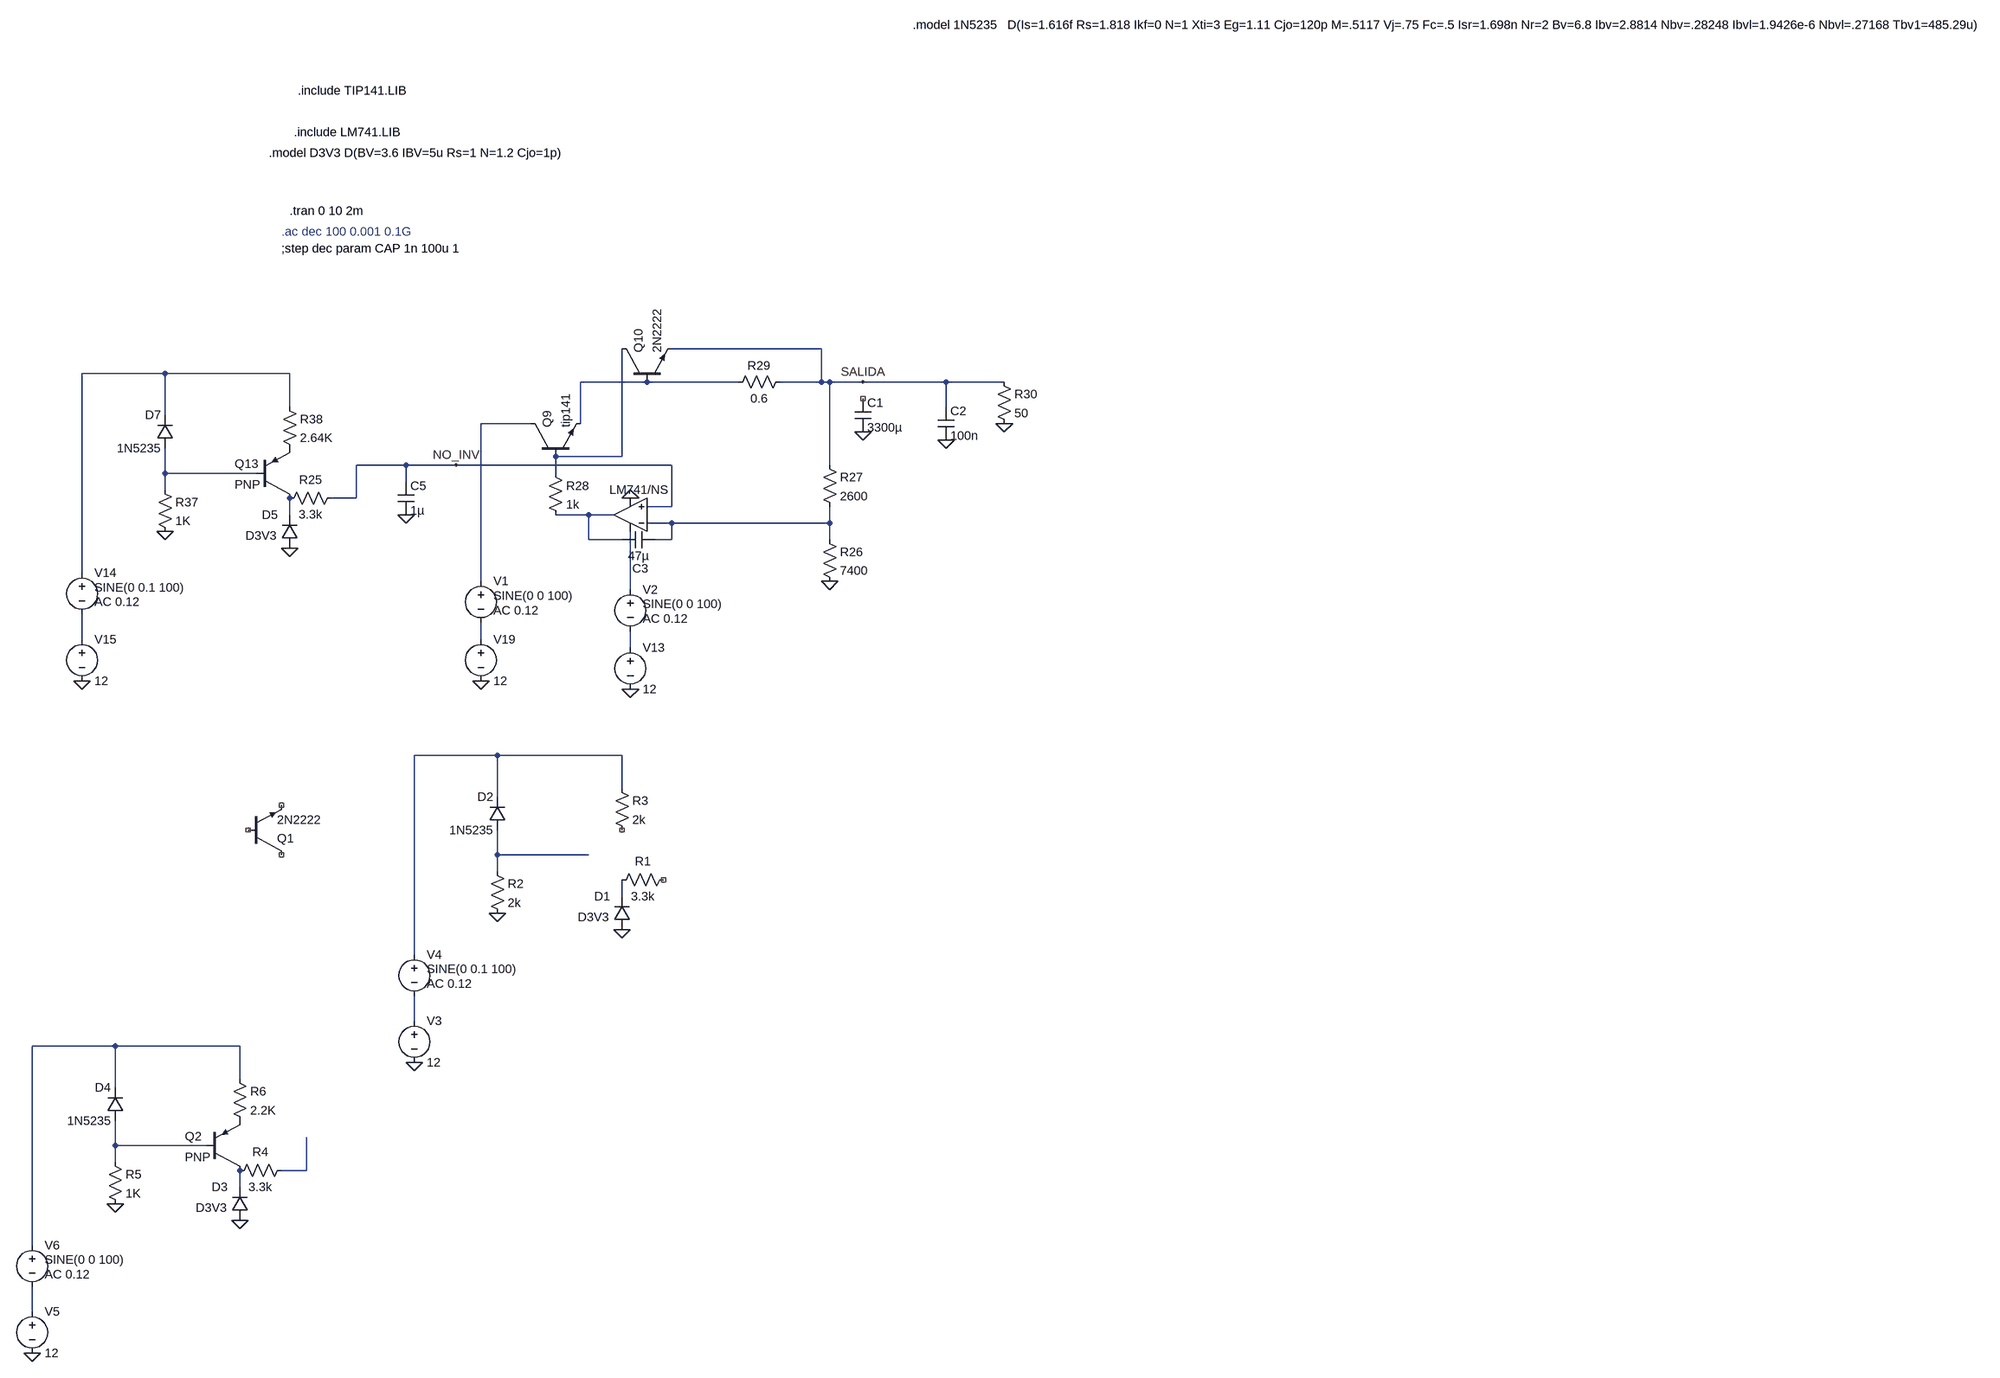
[diagram p0: schematic Estabilizador 5 V_version2.asc]
Estabilizador 5 V_version2.asc, the LTspice schematic file:
Version 4
SHEET 1 1496 2916
WIRE -1712 944 -2000 944
WIRE -2976 992 -3136 992
WIRE -2736 992 -2976 992
WIRE -2048 1008 -2176 1008
WIRE -1872 1008 -2048 1008
WIRE -1712 1008 -1712 944
WIRE -1712 1008 -1792 1008
WIRE -1696 1008 -1712 1008
WIRE -1632 1008 -1696 1008
WIRE -1472 1008 -1632 1008
WIRE -1360 1008 -1472 1008
WIRE -2736 1056 -2736 992
WIRE -1472 1056 -1472 1008
WIRE -2976 1072 -2976 992
WIRE -2272 1088 -2368 1088
WIRE -2176 1088 -2176 1008
WIRE -2096 1152 -2096 944
WIRE -2096 1152 -2224 1152
WIRE -2512 1168 -2608 1168
WIRE -2416 1168 -2512 1168
WIRE -2000 1168 -2416 1168
WIRE -1696 1168 -1696 1008
WIRE -2976 1184 -2976 1136
WIRE -2800 1184 -2976 1184
WIRE -2224 1184 -2224 1152
WIRE -2512 1200 -2512 1168
WIRE -2976 1216 -2976 1184
WIRE -2608 1232 -2608 1168
WIRE -2608 1232 -2656 1232
WIRE -2000 1248 -2000 1168
WIRE -2000 1248 -2048 1248
WIRE -2736 1264 -2736 1232
WIRE -2160 1264 -2224 1264
WIRE -2112 1264 -2160 1264
WIRE -2000 1280 -2048 1280
WIRE -1696 1280 -1696 1248
WIRE -1696 1280 -2000 1280
WIRE -2160 1312 -2160 1264
WIRE -2096 1312 -2160 1312
WIRE -2000 1312 -2000 1280
WIRE -2000 1312 -2032 1312
WIRE -1696 1312 -1696 1280
WIRE -3136 1376 -3136 992
WIRE -2368 1392 -2368 1088
WIRE -2080 1408 -2080 1296
WIRE -3136 1504 -3136 1456
WIRE -2368 1504 -2368 1472
WIRE -2080 1520 -2080 1488
WIRE -2336 1744 -2496 1744
WIRE -2096 1744 -2336 1744
WIRE -2096 1808 -2096 1744
WIRE -2336 1824 -2336 1744
WIRE -2336 1936 -2336 1888
WIRE -2160 1936 -2336 1936
WIRE -2336 1968 -2336 1936
WIRE -2096 2016 -2096 1984
WIRE -2496 2128 -2496 1744
WIRE -2496 2256 -2496 2208
WIRE -3072 2304 -3232 2304
WIRE -2832 2304 -3072 2304
WIRE -2832 2368 -2832 2304
WIRE -3072 2384 -3072 2304
WIRE -3072 2496 -3072 2448
WIRE -2896 2496 -3072 2496
WIRE -3072 2528 -3072 2496
WIRE -2704 2544 -2704 2480
WIRE -2704 2544 -2752 2544
WIRE -2832 2576 -2832 2544
WIRE -3232 2688 -3232 2304
WIRE -3232 2816 -3232 2768
FLAG -2080 1232 0
FLAG -2080 1600 0
FLAG -1696 1392 0
FLAG -2736 1328 0
FLAG -1360 1088 0
FLAG -3136 1584 0
FLAG -2976 1296 0
FLAG -2368 1584 0
FLAG -2512 1264 0
FLAG -1632 1008 SALIDA
FLAG -2416 1168 NO_INV
FLAG -1632 1104 0
FLAG -1472 1120 0
FLAG -2096 2080 0
FLAG -2496 2336 0
FLAG -2336 2048 0
FLAG -2832 2640 0
FLAG -3232 2896 0
FLAG -3072 2608 0
SYMBOL npn -2272 1152 R270
SYMATTR InstName Q9
SYMATTR Value tip141
SYMATTR Prefix X
SYMBOL voltage -2080 1504 R0
WINDOW 123 0 0 Left 2
WINDOW 39 0 0 Left 2
SYMATTR InstName V13
SYMATTR Value 12
SYMBOL res -2640 1216 R90
WINDOW 0 -4 56 VBottom 2
WINDOW 3 32 56 VTop 2
SYMATTR InstName R25
SYMATTR Value 3.3k
SYMBOL res -1712 1296 R0
SYMATTR InstName R26
SYMATTR Value 7400
SYMBOL res -1712 1152 R0
SYMATTR InstName R27
SYMATTR Value 2600
SYMBOL diode -2720 1328 R180
WINDOW 0 39 64 Left 2
WINDOW 3 41 24 Left 2
SYMATTR InstName D5
SYMATTR Value D3V3
SYMBOL res -2240 1168 R0
SYMATTR InstName R28
SYMATTR Value 1k
SYMBOL res -1776 992 R90
WINDOW 0 0 56 VBottom 2
WINDOW 3 32 56 VTop 2
SYMATTR InstName R29
SYMATTR Value 0.6
SYMBOL res -1376 992 R0
SYMATTR InstName R30
SYMATTR Value 50
SYMBOL npn -2096 1008 R270
SYMATTR InstName Q10
SYMATTR Value 2N2222
SYMBOL Opamps\\UniversalOpamp2 -2080 1264 R180
WINDOW 0 -74 48 Left 2
SYMATTR InstName LM741/NS
SYMBOL voltage -3136 1488 R0
WINDOW 123 0 0 Left 2
WINDOW 39 0 0 Left 2
SYMATTR InstName V15
SYMATTR Value 12
SYMBOL diode -2960 1136 R180
WINDOW 0 24 64 Left 2
WINDOW 3 24 0 Left 2
SYMATTR InstName D7
SYMATTR Value 1N5235
SYMBOL res -2992 1200 R0
SYMATTR InstName R37
SYMATTR Value 1K
SYMBOL res -2752 1040 R0
SYMATTR InstName R38
SYMATTR Value 2.64K
SYMBOL pnp -2800 1232 M180
WINDOW 0 -42 66 Left 2
WINDOW 3 -42 26 Left 2
SYMATTR InstName Q13
SYMBOL voltage -2368 1488 R0
WINDOW 123 0 0 Left 2
WINDOW 39 0 0 Left 2
SYMATTR InstName V19
SYMATTR Value 12
SYMBOL voltage -3136 1360 R0
WINDOW 3 24 44 Left 2
WINDOW 123 24 72 Left 2
WINDOW 39 0 0 Left 2
SYMATTR Value SINE(0 0.1 100)
SYMATTR Value2 AC 0.12
SYMATTR InstName V14
SYMBOL cap -2528 1200 R0
SYMATTR InstName C5
SYMATTR Value 1µ
SYMBOL cap -2032 1296 R90
WINDOW 0 87 29 VBottom 2
WINDOW 3 32 32 VTop 2
SYMATTR InstName C3
SYMATTR Value 47µ
SYMBOL voltage -2368 1376 R0
WINDOW 3 24 44 Left 2
WINDOW 123 24 72 Left 2
WINDOW 39 0 0 Left 2
SYMATTR Value SINE(0 0 100)
SYMATTR Value2 AC 0.12
SYMATTR InstName V1
SYMBOL voltage -2080 1392 R0
WINDOW 3 24 44 Left 2
WINDOW 123 24 72 Left 2
WINDOW 39 0 0 Left 2
SYMATTR Value SINE(0 0 100)
SYMATTR Value2 AC 0.12
SYMATTR InstName V2
SYMBOL cap -1648 1040 R0
SYMATTR InstName C1
SYMATTR Value 3300µ
SYMBOL cap -1488 1056 R0
SYMATTR InstName C2
SYMATTR Value 100n
SYMBOL npn -2816 1936 M180
SYMATTR InstName Q1
SYMATTR Value 2N2222
SYMBOL res -2000 1968 R90
WINDOW 0 -4 56 VBottom 2
WINDOW 3 32 56 VTop 2
SYMATTR InstName R1
SYMATTR Value 3.3k
SYMBOL diode -2080 2080 R180
WINDOW 0 39 64 Left 2
WINDOW 3 41 24 Left 2
SYMATTR InstName D1
SYMATTR Value D3V3
SYMBOL voltage -2496 2240 R0
WINDOW 123 0 0 Left 2
WINDOW 39 0 0 Left 2
SYMATTR InstName V3
SYMATTR Value 12
SYMBOL diode -2320 1888 R180
WINDOW 0 24 64 Left 2
WINDOW 3 24 0 Left 2
SYMATTR InstName D2
SYMATTR Value 1N5235
SYMBOL res -2352 1952 R0
SYMATTR InstName R2
SYMATTR Value 2k
SYMBOL res -2112 1792 R0
SYMATTR InstName R3
SYMATTR Value 2k
SYMBOL voltage -2496 2112 R0
WINDOW 3 24 44 Left 2
WINDOW 123 24 72 Left 2
WINDOW 39 0 0 Left 2
SYMATTR Value SINE(0 0.1 100)
SYMATTR Value2 AC 0.12
SYMATTR InstName V4
SYMBOL res -2736 2528 R90
WINDOW 0 -4 56 VBottom 2
WINDOW 3 32 56 VTop 2
SYMATTR InstName R4
SYMATTR Value 3.3k
SYMBOL diode -2816 2640 R180
WINDOW 0 39 64 Left 2
WINDOW 3 41 24 Left 2
SYMATTR InstName D3
SYMATTR Value D3V3
SYMBOL voltage -3232 2800 R0
WINDOW 123 0 0 Left 2
WINDOW 39 0 0 Left 2
SYMATTR InstName V5
SYMATTR Value 12
SYMBOL diode -3056 2448 R180
WINDOW 0 24 64 Left 2
WINDOW 3 24 0 Left 2
SYMATTR InstName D4
SYMATTR Value 1N5235
SYMBOL res -3088 2512 R0
SYMATTR InstName R5
SYMATTR Value 1K
SYMBOL res -2848 2352 R0
SYMATTR InstName R6
SYMATTR Value 2.2K
SYMBOL pnp -2896 2544 M180
WINDOW 0 -42 66 Left 2
WINDOW 3 -42 26 Left 2
SYMATTR InstName Q2
SYMBOL voltage -3232 2672 R0
WINDOW 3 24 44 Left 2
WINDOW 123 24 72 Left 2
WINDOW 39 0 0 Left 2
SYMATTR Value SINE(0 0 100)
SYMATTR Value2 AC 0.12
SYMATTR InstName V6
TEXT -2776 560 Left 2 !.model D3V3 D(BV=3.6 IBV=5u Rs=1 N=1.2 Cjo=1p)
TEXT -2736 672 Left 2 !.tran 0 10 2m
TEXT -2720 440 Left 2 !.include TIP141.LIB
TEXT -2728 520 Left 2 !.include LM741.LIB
TEXT -2752 744 Left 2 !;step dec param CAP 1n 100u 1
TEXT -1536 -152 Left 2 !.model 1N5235   D(Is=1.616f Rs=1.818 Ikf=0 N=1 Xti=3 Eg=1.11 Cjo=120p M=.5117 Vj=.75 Fc=.5 Isr=1.698n Nr=2 Bv=6.8 Ibv=2.8814 Nbv=.28248 Ibvl=1.9426e-6 Nbvl=.27168 Tbv1=485.29u)
TEXT -2752 712 Left 2 ;.ac dec 100 0.001 0.1G

The netlist it stands for:
* Estabilizador 5 V_version2.asc
XQ9 N003 N004 N002 tip141  ; pins C B E
V13 N012 0 12
R25 NO_INV N006 3.3k
R26 N008 0 7400
R27 SALIDA N008 2600
D5 0 N006 D3V3
R28 N004 N007 1k
R29 SALIDA N002 0.6
R30 SALIDA 0 50
Q10 N004 N002 SALIDA 0 2N2222
XLM741/NS NO_INV N008 N009 0 N007 level.2 Avol=1Meg GBW=10Meg Slew=10Meg ilimit=25m rail=0 Vos=0 phimargin=45 en=0 enk=0 in=0 ink=0 Rin=500Meg  ; pins IN+ IN- V+ V- OUT
V15 N010 0 12
D7 N005 N001 1N5235
R37 N005 0 1K
R38 N001 P001 2.64K
Q13 N006 N005 P001 0 PNP
V19 N011 0 12
V14 N001 N010 SINE(0 0.1 100) AC 0.12
C5 NO_INV 0 1µ
C3 N008 N007 47µ
V1 N003 N011 SINE(0 0 100) AC 0.12
V2 N009 N012 SINE(0 0 100) AC 0.12
C1 NC_01 0 3300µ
C2 SALIDA 0 100n
Q1 NC_02 NC_03 NC_04 0 2N2222
R1 NC_05 N015 3.3k
D1 0 N015 D3V3
V3 N016 0 12
D2 N014 N013 1N5235
R2 N014 0 2k
R3 N013 NC_06 2k
V4 N013 N016 SINE(0 0.1 100) AC 0.12
R4 N019 N020 3.3k
D3 0 N020 D3V3
V5 N021 0 12
D4 N018 N017 1N5235
R5 N018 0 1K
R6 N017 P002 2.2K
Q2 N020 N018 P002 0 PNP
V6 N017 N021 SINE(0 0 100) AC 0.12
.model D D
.lib standard.dio
.model NPN NPN
.model PNP PNP
.lib standard.bjt
.model D3V3 D(BV=3.6 IBV=5u Rs=1 N=1.2 Cjo=1p)
.tran 0 10 2m
.include TIP141.LIB
.include LM741.LIB
;step dec param CAP 1n 100u 1
.model 1N5235   D(Is=1.616f Rs=1.818 Ikf=0 N=1 Xti=3 Eg=1.11 Cjo=120p M=.5117 Vj=.75 Fc=.5 Isr=1.698n Nr=2 Bv=6.8 Ibv=2.8814 Nbv=.28248 Ibvl=1.9426e-6 Nbvl=.27168 Tbv1=485.29u)
* .ac dec 100 0.001 0.1G
.lib UniversalOpamps2.sub
.backanno
.end